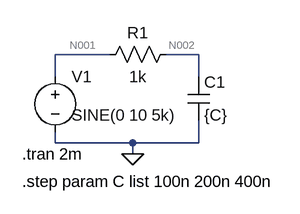
[diagram p0: schematic Draft1.asc]
Draft1.asc, the LTspice schematic file:
Version 4
SHEET 1 880 680
WIRE 144 32 64 32
WIRE 272 32 224 32
WIRE 64 64 64 32
WIRE 272 64 272 32
WIRE 64 160 64 144
WIRE 176 160 64 160
WIRE 272 160 272 128
WIRE 272 160 176 160
WIRE 176 176 176 160
FLAG 176 176 0
SYMBOL res 240 16 R90
WINDOW 0 0 56 VBottom 2
WINDOW 3 32 56 VTop 2
SYMATTR InstName R1
SYMATTR Value 1k
SYMBOL cap 256 64 R0
SYMATTR InstName C1
SYMATTR Value {C}
SYMBOL voltage 64 48 R0
WINDOW 3 24 72 Left 2
WINDOW 123 24 44 Left 2
WINDOW 39 0 0 Left 0
SYMATTR InstName V1
SYMATTR Value SINE(0 10 5k)
TEXT 16 176 Left 2 !.tran 2m
TEXT 16 216 Left 2 !.step param C list 100n 200n 400n

The netlist it stands for:
* Draft1.asc
R1 N002 N001 1k
C1 N002 0 {C}
V1 N001 0 SINE(0 10 5k)
.tran 2m
.step param C list 100n 200n 400n
.backanno
.end

* Results of the author's LTspice run, read from the files saved beside the schematic
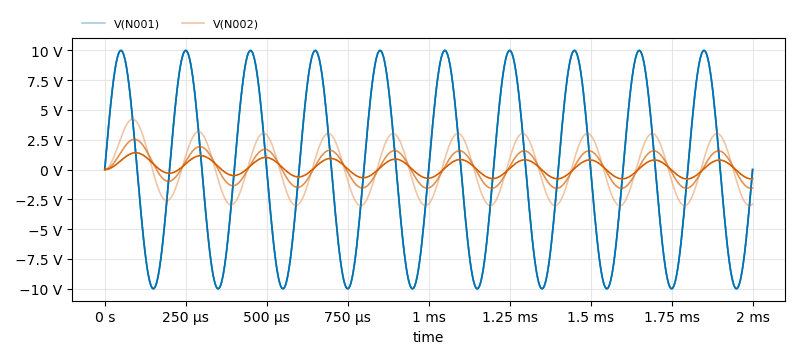
[diagram p1: Transient Analysis of Draft1.asc, plotted from the saved traces]
* Transient Analysis, 3 runs:
*   V(N001) [c=1e-07]: min -10 V, max 10 V, average 50.28 µV, rms 7.071 V, last 0 V
*   V(N001) [c=2e-07]: min -10 V, max 10 V, average -1.581 µV, rms 7.071 V, last 0 V
*   V(N001) [c=4e-07]: min -10 V, max 10 V, average -67.95 µV, rms 7.071 V, last 0 V
*   V(N002) [c=1e-07]: min -3.029 V, max 4.226 V, average 144.5 mV, rms 2.19 V, last -2.89 V
*   V(N002) [c=2e-07]: min -1.57 V, max 2.542 V, average 155.1 mV, rms 1.163 V, last -1.552 V
*   V(N002) [c=4e-07]: min -786.6 mV, max 1.413 V, average 157 mV, rms 613.4 mV, last -785.2 mV